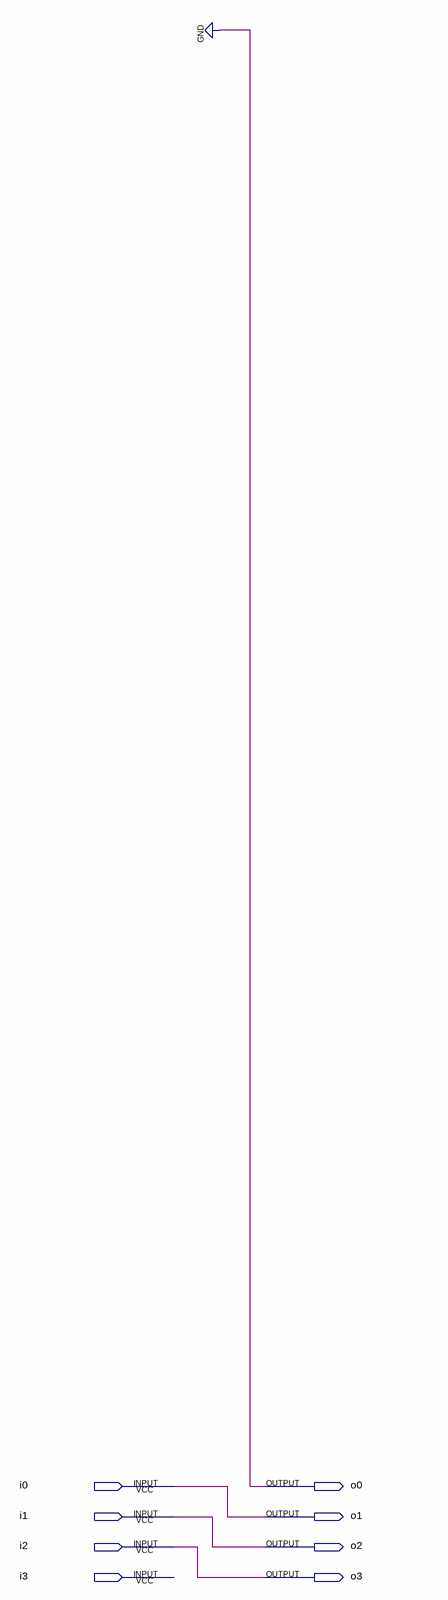
[diagram p0: schematic sheet]
// Quartus schematic multiplicador.bdf as structural Verilog: 0 symbols, 8 pins
module multiplicador (
  input  i0,
  input  i1,
  input  i2,
  input  i3,
  output o0,
  output o1,
  output o2,
  output o3
);


  assign o0 = 1'b0;
  assign o1 = i0;
  assign o2 = i1;
  assign o3 = i2;
endmodule
